# Altium schematic sheet DryContact.SchDoc: Dry Contact
size A4; Organization: ORGANIZATION; Address1: ADDRESS 1; Address2: ADDRESS 2; Address3: ADDRESS 3; Address4: ADDRESS 4; Revision: -; ENG_APP_DATE: --/--/--; DSN_APP_DATE: --/--/--; CHK_APP_DATE: --/--/--
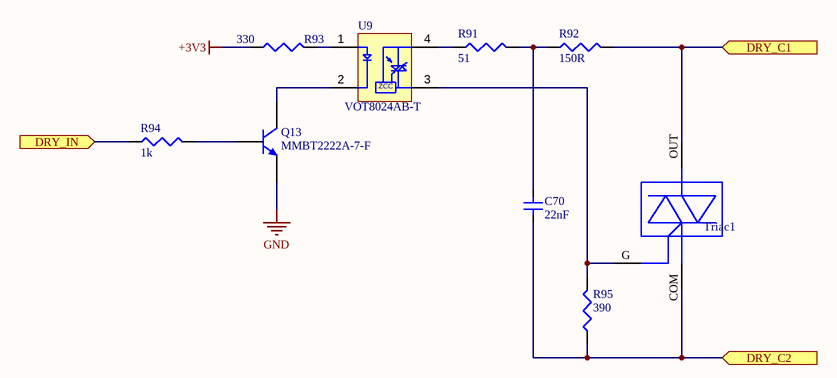
[diagram p0: DryContact.SchDoc]

## Parts
C70  value 22nF  [1206]  (hidden comment: CMP-001-00171-1)
Q13  MMBT2222A-7-F  [SOT23127P600-8N]
R91  value 51  [R0603]  (hidden comment: CMP-009-00208-1)
R92  value 150R  [R0603]  (hidden comment: CMP-009-00192-1)
R93  value 330  [R0603]  (hidden comment: RC0603FR-07330RL)
R94  value 1k  [R0603]  (hidden comment: CMP-009-00194-1)
R95  value 390  [R0603]  (hidden comment: CMP-009-00224-1)
Triac1  ACST210-8BTR  [ACST210_DPAK]  (value not drawn)
U9  VOT8024AB-T  [SW-TRIAC]

## Ports
DRY_C1 (in), DRY_C2 (in), DRY_IN (in)

## Nets
+3V3: R93.2
GND: Q13.1(E)
DRY_C1: R92.2 Triac1.OUT ; port DRY_C1
DRY_C2: C70.1 R95.1 Triac1.COM ; port DRY_C2
DRY_IN: R94.1 ; port DRY_IN
NetC70_2: C70.2 R91.2 R92.1
NetQ13_2: Q13.2(B) R94.2
NetQ13_3: Q13.3(C) U9.2(C)
NetR91_1: R91.1 U9.4(MT2)
NetR93_1: R93.1 U9.1(A)
NetR95_2: R95.2 Triac1.G U9.3(MT1)

## Notes on the sheet
- APPROVALS
- DATE
- PROJECT
- Kish Spark Building
- No. 8, Avesta Street
- ENG:
- DSN:
- CHK:
- PROJECT REVISION:
- DESIGN ITEM:
- DOCUMENT REVISION:
- Tehran, Iran
- Seoul Street, Sheikh Bahaie
- SIZE
- REV
- SCALE:
- CAGE CODE
- A4
- FILE NAME
- TITLE
- SHEET
- OF
- (in symbol CMP-076-000009-2) ZCC

## Library data of the parts
C70 = CMP-001-00171-1: Capacitor SMD Ceramic 1206 400Vdc X7R Dielectric 0.022uF ±10% 125°C T/R; Manufacturer: Kyocera AVX; Manufacturer Part Number: 12068C223KAT2A; Voltage Rating (DC): 400V; RoHS: Yes; Category: Ceramic Capacitors; Stock 1: 2302; Pricing 1: 1=0.72, 10=0.531, 50=0.531, 100=0.364, 1000=0.243, 10000=0.215 (USD); Min Operating Temperature: -55°C; Max Operating Temperature: 125°C; Package Quantity: 2000; Tolerance: 10%; Packaging: Tape and Reel; Dielectric: X7R; ComponentLink1URL: http://www.mouser.com/ds/2/40/X7RDielectric-777024.pdf?src-supplier=Mouser; ComponentLink1Description: http://www.mouser.com/ds/2/40/X7RDielectric-777024.pdf?src-supplier=Mouser; Design Item ID: 12068C223KAT2A; Component Type: Standard; Pin Count: 2; Source: V4-TEL.SCHLIB
Q13 = CMP-012-00003-2: MMBT2222 Series NPN 350 mW 40 V 600 mA SMT Small Signal Transistor - SOT-23; Manufacturer: Diodes; Current Rating: 600mA; Voltage Rating: 40V; Collector Base Voltage (VCBO): 75V; Collector Emitter Saturation Voltage: 1V; Current: 1A; Element Configuration: Single; Emitter Base Voltage (VEBO): 6V; Frequency: 300MHz; hFE Min: 100; Max Power Dissipation: 300mW; Number of Elements: 1; Power Dissipation: 350mW; Case/Package: SOT-23-3; Pins: 3; RoHS Compliant: Yes; Min Operating Temperature: -55°C; Max Operating Temperature: 150°C; Design Item ID: MMBT2222A-7-F; Category: BJTs; Collector Emitter Breakdown Voltage: 40V; Collector Emitter Voltage (VCEO): 40V; Collector-emitter Voltage-Max: 1V; Component Type: Standard; Contact Plating: Tin,Matte; Continuous Collector Current: 600mA; Gain Bandwidth Product: 300MHz; Height: 1mm; Lead Free: Lead Free; Length: 3.05mm; Manufacturer Part Number: MMBT2222A-7-F; Max Collector Current: 600mA; Max Frequency: 300MHz; Mount: Surface Mount; Package Quantity: 3000; Packaging: Tape and Reel; Pin Count: 3; Polarity: NPN; Pricing 1: 1=0.14000, 10=0.13300, 50=0.13300, 100=0.07200, 500=0.04500, 1000=0.03100, 3000=0.02300, 9000=0.02000, 10000=0.02000, 24000=0.01800, 45000=0.01500 (USD); Radiation Hardening: No; Reach SVHC Compliant: Yes; RoHS: Yes; Series: Automotive, AEC-Q101; Source: PTZ.SCHLIB; Stock 1: 1743698; Termination: SMD/SMT; Transition Frequency: 300MHz; Voltage: 40V; Voltage Rating (DC): 40V; Weight: 0.000282oz; Width: 1.4mm; ComponentLink1Description: https://datasheet.ciiva.com/15139/getdatasheetpartid-82692-15139078.pdf?src-supplier=Verical; ComponentLink1URL: https://datasheet.ciiva.com/15139/getdatasheetpartid-82692-15139078.pdf?src-supplier=Verical; ComponentLink2Description: https://datasheet.ciiva.com/8029/ds30041-8029709.pdf?src-supplier=Element14; ComponentLink2URL: https://datasheet.ciiva.com/8029/ds30041-8029709.pdf?src-supplier=Element14; ComponentLink3Description: https://datasheet.ciiva.com/11201/ds30041-11201864.pdf?src-supplier=Avnet; ComponentLink3URL: https://datasheet.ciiva.com/11201/ds30041-11201864.pdf?src-supplier=Avnet; ComponentLink4Description: https://datasheet.ciiva.com/16199/ds30041-16199045.pdf?src-supplier=Future+Electronics; ComponentLink4URL: https://datasheet.ciiva.com/16199/ds30041-16199045.pdf?src-supplier=Future+Electronics; ComponentLink5Description: https://datasheet.ciiva.com/11198/ds30041-11198965.pdf?src-supplier=Avnet; ComponentLink5URL: https://datasheet.ciiva.com/11198/ds30041-11198965.pdf?src-supplier=Avnet; ComponentLink6Description: https://datasheet.ciiva.com/972/ds30041-972551.pdf?src-supplier=Digi-Key; ComponentLink6URL: https://datasheet.ciiva.com/972/ds30041-972551.pdf?src-supplier=Digi-Key; ComponentLink7Description: https://datasheet.ciiva.com/972/ds30041-972552.pdf?src-supplier=Digi-Key; ComponentLink7URL: https://datasheet.ciiva.com/972/ds30041-972552.pdf?src-supplier=Digi-Key; ComponentLink8Description: https://datasheet.ciiva.com/972/ds30041-972550.pdf?src-supplier=Digi-Key; ComponentLink8URL: https://datasheet.ciiva.com/972/ds30041-972550.pdf?src-supplier=Digi-Key
R91 = CMP-009-00208-1: Thick Film Resistors - SMD 0.2W 51ohm 1% 100ppm; Manufacturer 1: KOA Speer; Manufacturer Part Number 1: SG73S1JTTD51R0F; Power Rating: 200mW; Voltage Rating: 50V; Temperature Coefficient: 100ppm/°C; RoHS: Yes; Category: Chip SMD Resistors; Stock 1: 9823; Pricing 1: 1=0.20000, 10=0.13500, 50=0.13500, 100=0.05100, 1000=0.02400, 10000=0.01500 (USD); Case/Package: 0603; Case Code (Metric): 1608; Min Operating Temperature: -55°C; Max Operating Temperature: 155°C; Packaging: Tape and Reel; Package Quantity: 5000; Tolerance: 1%; Resistor Type: Thick Film; Termination: SMD/SMT; Voltage Rating (DC): 50V; Series: SG73; Length: 1.6mm; Width: 0.8mm; Height: 0.45mm; RoHS Compliant: Yes; ComponentLink1URL: http://www.koaspeer.com/catimages/Products/SG73/SG73.pdf?src-supplier=Mouser; ComponentLink1Description: http://www.koaspeer.com/catimages/Products/SG73/SG73.pdf?src-supplier=Mouser; Pins: 2; Design Item ID: SG73S1JTTD51R0F; Source: PTZLib.SchLib
R92 = CMP-009-00192-1: TE CONNECTIVITY - CRGP0603F150R - Chipwiderstand, Oberflächenmontage, 0603 [Metrisch 1608], 150 ohm, CRGP Series, 50 V, Dickschicht; RoHS: Yes; Category: Chip SMD Resistors; Stock 1: 18693; Pricing 1: 1=0.17000, 10=0.14800, 100=0.05780, 1000=0.02420, 2500=0.02218 (USD); ComponentLink1URL: https://4donline.ihs.com/images/VipMasterIC/IC/TYEL/TYEL-S-A0005460475/TYEL-S-A0005460475-1.pdf?hkey=52A5661711E402568146F3353EA87419&src-supplier=Farnell; ComponentLink1Description: https://4donline.ihs.com/images/VipMasterIC/IC/TYEL/TYEL-S-A0005460475/TYEL-S-A0005460475-1.pdf?hkey=52A5661711E402568146F3353EA87419&src-supplier=Farnell; ComponentLink2URL: https://4donline.ihs.com/images/VipMasterIC/IC/TYEL/TYEL-S-A0005460475/TYEL-S-A0005460475-1.pdf?hkey=52A5661711E402568146F3353EA87419&src-supplier=Newark; ComponentLink2Description: https://4donline.ihs.com/images/VipMasterIC/IC/TYEL/TYEL-S-A0005460475/TYEL-S-A0005460475-1.pdf?hkey=52A5661711E402568146F3353EA87419&src-supplier=Newark; RoHS Compliant: Yes; Design Item ID: CRGP0603F150R; Manufacturer 1: TE Connectivity; Manufacturer Part Number 1: CRGP0603F150R; Source: PTZLib.SchLib
R93 = CMP-009-00242-1: Res Thick Film 0603 330 Ohm 1% 0.1W(1/10W) ±100ppm/C Pad SMD T/R; Manufacturer: Yageo; Manufacturer Part Number: RC0603FR-071K54L; Voltage Rating: 50V; Max Power Dissipation: 100mW; Temperature Coefficient: 100ppm/°C; Case/Package: 0603; RoHS Compliant: Yes; Min Operating Temperature: -55°C; Max Operating Temperature: 155°C; Tolerance: 1%; Design Item ID: RC0603FR-071K54L; Case Code (Metric): 1608; Category: Chip SMD Resistors; Construction: Rectangular; Depth: 0.8mm; Features: Moisture Resistant; Height: 450um; Lead Free: Lead Free; Length: 1.6mm; Military Standard: Not; Number of Terminations: 2; Package Quantity: 1; Packaging: Cut Tape; Power Rating: 100mW; Pricing 1: 1=0.10000, 10=0.01800, 50=0.01800, 100=0.00600, 1000=0.00500, 10000=0.00300 (USD); Resistor Type: Thick Film; RoHS: Yes; Series: RC; Size Code: 0603; Stock 1: 61319; Termination: SMD/SMT; Voltage Rating (DC): 50V; Width: 800um; ComponentLink1Description: https://datasheet.ciiva.com/2454/pyu-r-int-thick-7-2454405.pdf?src-supplier=Digi-Key; ComponentLink1URL: https://datasheet.ciiva.com/2454/pyu-r-int-thick-7-2454405.pdf?src-supplier=Digi-Key; ComponentLink2Description: https://datasheet.ciiva.com/2454/pyu-r-int-thick-7-2454406.pdf?src-supplier=Digi-Key; ComponentLink2URL: https://datasheet.ciiva.com/2454/pyu-r-int-thick-7-2454406.pdf?src-supplier=Digi-Key; ComponentLink3Description: https://datasheet.ciiva.com/2454/pyu-r-int-thick-7-2454407.pdf?src-supplier=Digi-Key; ComponentLink3URL: https://datasheet.ciiva.com/2454/pyu-r-int-thick-7-2454407.pdf?src-supplier=Digi-Key; Pins: 2
R94 = CMP-009-00194-1: Res Thick Film 0603 1K Ohm 1% 1/10W ±100ppm/°C Molded SMD Paper T/R; Manufacturer: Yageo; Manufacturer Part Number: AC0603FR-071KL; Power Rating: 100mW; Voltage Rating: 50V; RoHS: Yes; Category: Chip SMD Resistors; Stock 1: 617396; Pricing 1: 1=0.10000, 10=0.02900, 50=0.02900, 100=0.01200, 1000=0.00500, 10000=0.00300 (USD); Case/Package: 0603; Case Code (Metric): 1608; Size Code: 0603; Min Operating Temperature: -55°C; Max Operating Temperature: 155°C; Tolerance: 1%; Packaging: Tape and Reel; Package Quantity: 1; Resistor Type: Thick Film; Number of Terminations: 2; Termination: SMD/SMT; Max Power Dissipation: 100mW; Temperature Coefficient: 100ppm/°C; Features: Moisture Resistant,Automotive AEC-Q200,Anti-Sulfur; Series: AC; Construction: Rectangular; Length: 0.063inch; Width: 0.031inch; Height: 0.022inch; Depth: 0.8mm; Military Standard: Not; Lead Free: Lead Free; RoHS Compliant: Yes; ComponentLink1URL: https://datasheet.ciiva.com/5558/pyu-ac-51-rohs-l-2-5558269.pdf?src-supplier=Mouser; ComponentLink1Description: https://datasheet.ciiva.com/5558/pyu-ac-51-rohs-l-2-5558269.pdf?src-supplier=Mouser; Design Item ID: AC0603FR-071KL; Source: PTZLib.SchLib
R95 = CMP-009-00224-1: Res Thick Film 0603 390 Ohm 1% 1/10W 100ppm/C Molded SMD Paper T/R; Manufacturer 1: Yageo; Manufacturer Part Number 1: RC0603FR-13390RL; Temperature Coefficient: 100ppm/°C; Power Rating: 100mW; Voltage Rating: 50V; RoHS: Yes; Category: Chip SMD Resistors; Stock 1: 12402; Case/Package: 0603; Contact Plating: Tin,Matte; Case Code (Metric): 1608; Min Operating Temperature: -55°C; Max Operating Temperature: 155°C; Tolerance: 1%; Resistor Type: Thick Film; Packaging: Tape and Reel; Termination: SMD/SMT; Series: RC; Construction: Rectangular; Length: 1.6mm; Width: 0.8mm; Height: 0.45mm; Depth: 0.8mm; Military Standard: Not; RoHS Compliant: Yes; ComponentLink1URL: https://datasheet.ciiva.com/8885/pyu-rc0603-51-rohs-l-4-8885886.pdf?src-supplier=Avnet; ComponentLink1Description: https://datasheet.ciiva.com/8885/pyu-rc0603-51-rohs-l-4-8885886.pdf?src-supplier=Avnet; Pricing 1: 1=0.10000, 10=0.02500, 50=0.02500, 100=0.01100, 1000=0.00500, 10000=0.00400 (USD); Design Item ID: RC0603FR-13390RL; Source: PTZLib.SchLib
Triac1 = CMP-011-00014-1: Triacs Triac Crowbar 10mA Switch 2A 800V; Manufacturer 1: STMicroelectronics; Element Configuration: Single; RoHS: Yes; Category: TRIACs; Pricing 1: 1=0.75000, 10=0.65700 (USD); Mount: Surface Mount; Case/Package: DPAK; Weight: 0.009185oz; Min Operating Temperature: -40°C; Max Operating Temperature: 125°C; Packaging: Tape and Reel; Package Quantity: 2500; RMS Current (Irms): 2A; Hold Current: 10mA; Series: ACS™/A.S.D®; Radiation Hardening: No; Lead Free: Lead Free; RoHS Compliant: Yes; ComponentLink1URL: https://datasheet.ciiva.com/15140/getdatasheetpartid-256875-15140675.pdf?src-supplier=Verical; ComponentLink1Description: https://datasheet.ciiva.com/15140/getdatasheetpartid-256875-15140675.pdf?src-supplier=Verical; Pins: 3; Voltage Rating: 800V; Design Item ID: ACST210-8BTR; Contact Plating: Tin,Matte; Manufacturer Part Number 1: ACST210-8BTR; Source: PTZLib.SchLib; Stock 1: 60; ComponentLink2Description: https://datasheet.ciiva.com/17423/cd00153575-17423141.pdf?src-supplier=Avnet+Europe; ComponentLink2URL: https://datasheet.ciiva.com/17423/cd00153575-17423141.pdf?src-supplier=Avnet+Europe
U9 = CMP-076-000009-2: Optocoupler Triac AC-OUT 1-Channel 800VDRM 4-Pin Surface Mount T/R; Manufacturer: Vishay; Number of Channels: 1; RMS Current (Irms): 100mA; Hold Current: 400uA; Forward Voltage: 1.2V; Manufacturer Part Number: VOT8024AB-T; RoHS: Yes; Case/Package: SMD/SMT; Min Operating Temperature: -55°C; Max Operating Temperature: 110°C; Series: -; Packaging: Cut Tape; RoHS Compliant: Yes; Design Item ID: VOT8024AB-T; Component Type: Standard; Mounting Technology: Surface Mount; Pins: 4